# Altium schematic sheet Harvester_Solar.SchDoc
size A; SheetNumber: 6
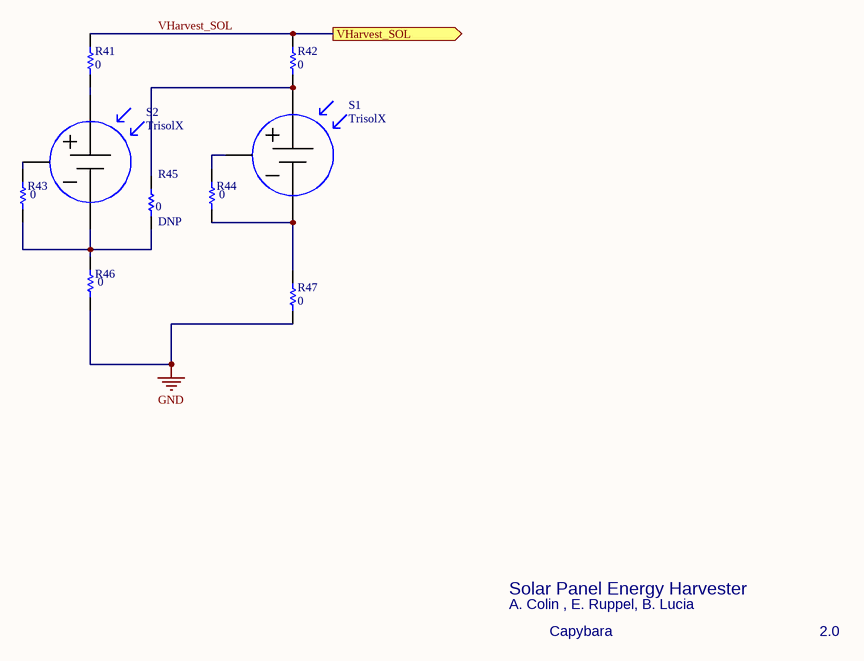
[diagram p0: Harvester_Solar.SchDoc]

## Parts
R41  value 0  [0603]  (hidden comment: Res)
R42  value 0  [0603]  (hidden comment: Res)
R43  value 0  [0603]  (hidden comment: Res)
R44  value 0  [0603]  (hidden comment: Res)
R45  DNP  value 0  [0603]
R46  value 0  [0603]  (hidden comment: Res)
R47  value 0  [0603]  (hidden comment: Res)
S1  TrisolX  [TricoLX - Basic_V3_MIRROR_STRAIGHT_OR_IXYS]
S2  TrisolX  [TricoLX - Basic_V3_MIRROR_STRAIGHT_OR_IXYS]

## Ports
VHarvest_SOL (out)

## Nets
GND: R46.1 R47.1
VHarvest_SOL: R41.2 R42.2 ; port VHarvest_SOL
NetR41_1: R41.1 S2.1(pos)
NetR42_1: R42.1 R45.2 S1.1(pos)
NetR43_1: R43.1 R45.1 R46.2 S2.2(neg)
NetR43_2: R43.2 S2.3(OR)
NetR44_1: R44.1 R47.2 S1.2(neg)
NetR44_2: R44.2 S1.3(OR)

## Notes on the sheet
- Solar Panel Energy Harvester
- A. Colin , E. Ruppel, B. Lucia
- Capybara
- 2.0

## Library data of the parts
R41-R47 = Res: Chip Resistor (Surface Mount); Manufacturer: Yageo; Manufacturer Part Number: RC0603JR-070RL; Rating: *; Note: *; Distributor: Digi-Key; Distributor Part Number: 311-0.0GRCT-ND
S1 S2 = TrisolX_Solar_Wings: TrisolX Solar Wings; Manufacturer: TrisolX; Manufacturer Part Number: TrisolX Solar Wings; Rating: *; Value: *; Note: *; Distributor: *; Distributor Part Number: *; DataSheet: http://www.trisolx.com/wp-content/uploads/2015/03/TrisolX-Solar-Wing-Data-Sheet1.pdf; Digi-Key Part Number: *